# Altium schematic sheet USB.SchDoc
size A4; SheetNumber: 4; SheetTotal: 4
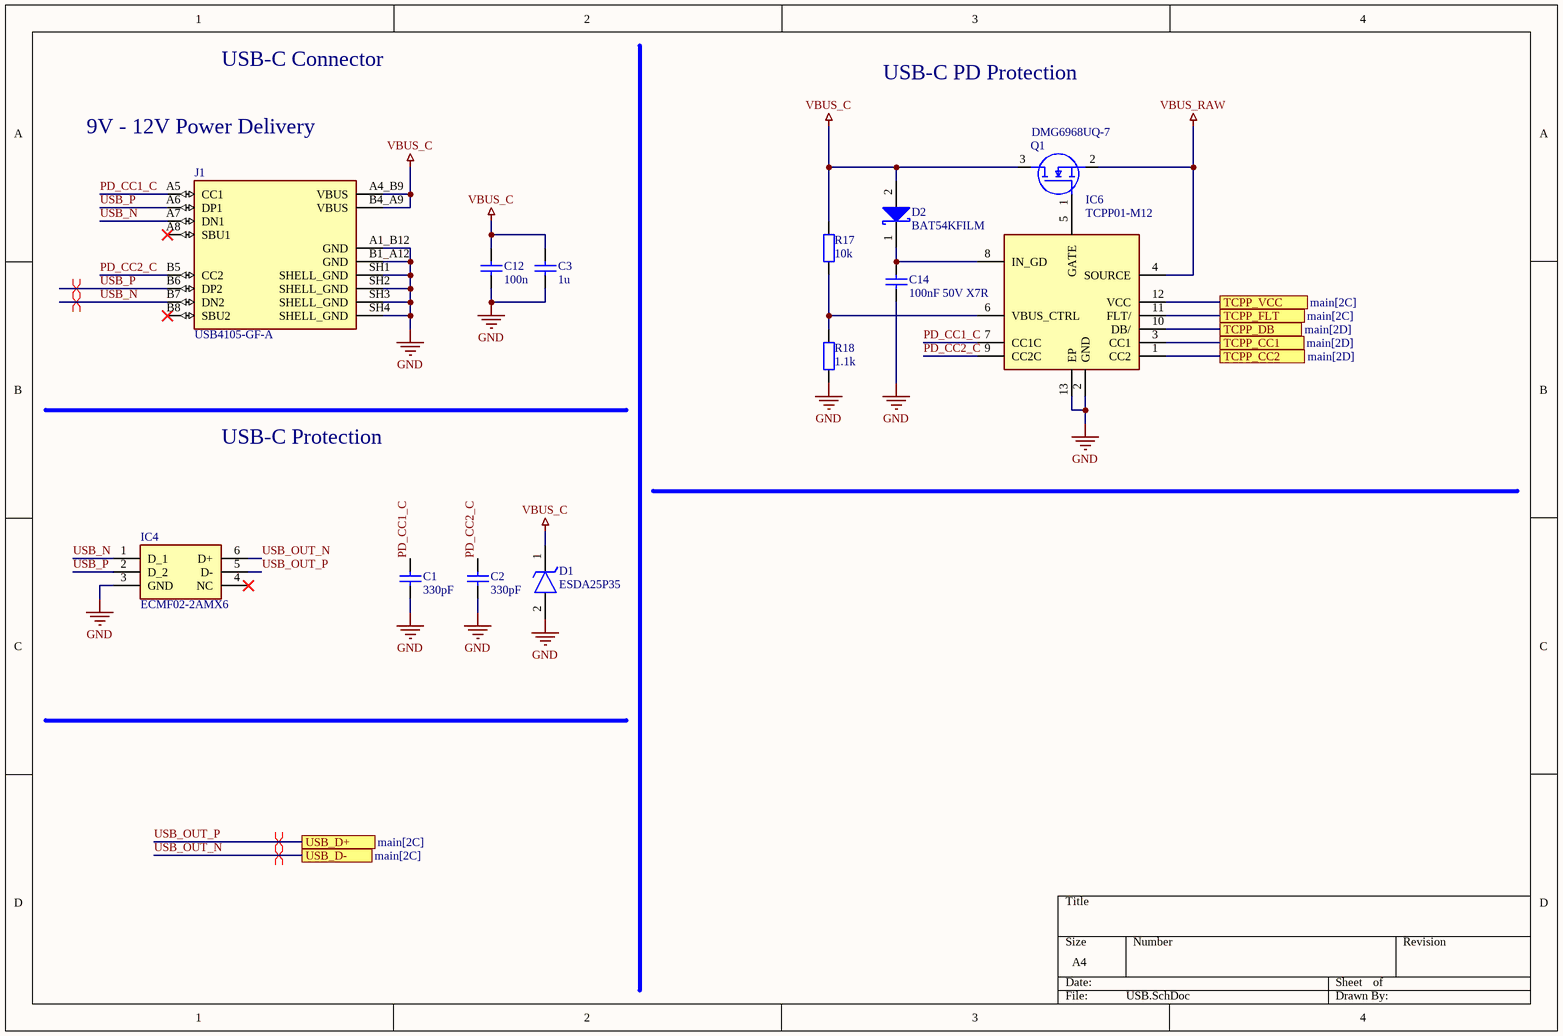
[diagram p0: USB.SchDoc]

## Parts
C1  330pF  [1608[0603]]
C2  330pF  [1608[0603]]
C3  1u  [1608[0603]]
C12  100n  [1608[0603]]
C14  100nF 50V X7R  [1608[0603]]
D1  ESDA25P35  [ESDA25P351U1M]
D2  BAT54KFILM  [SODFL1608X70N]
IC4  ECMF02-2AMX6  [SON50P150X170X55-6N-D]
IC6  TCPP01-M12  [QFN50P300X300X100-13N-D]
J1  USB4105-GF-A  [GCT_USB4105-GF-A]
Q1  DMG6968UQ-7  [SOT96P240X110-3N]
R17  10k  [J1-0603]
R18  1.1k  [J1-0603]

## Ports
TCPP_CC1 (see main[2D]), TCPP_CC2 (see main[2D]), TCPP_DB (see main[2D]), TCPP_FLT (see main[2C]), TCPP_VCC (see main[2C]), USB_D+ (see main[2C]), USB_D- (see main[2C])

## Nets
GND: C1.1 C2.1 C3.1 C12.1 C14.1 D1.2(A) IC4.3(GND) IC6.2(GND) IC6.13(EP) J1.A1_B12(GND) J1.B1_A12(GND) J1.SH1(SHELL_GND) J1.SH2(SHELL_GND) J1.SH3(SHELL_GND) J1.SH4(SHELL_GND) R18.1
VBUS_C: C3.2 C12.2 D1.1(K) D2.2(A) J1.A4_B9(VBUS) J1.B4_A9(VBUS) Q1.3(D) R17.2
VBUS_RAW: IC6.4(SOURCE) Q1.2(S)
PD_CC1_C: C1.2 IC6.7(CC1C) J1.A5(CC1)
PD_CC2_C: C2.2 IC6.9(CC2C) J1.B5(CC2)
TCPP_CC1: IC6.3(CC1) ; port TCPP_CC1
TCPP_CC2: IC6.1(CC2) ; port TCPP_CC2
TCPP_DB: IC6.10(DB/) ; port TCPP_DB
TCPP_FLT: IC6.11(FLT/) ; port TCPP_FLT
TCPP_VCC: IC6.12(VCC) ; port TCPP_VCC
USB_N: IC4.1(D_1) J1.A7(DN1) J1.B7(DN2)
USB_OUT_N: IC4.6(D+) ; port USB_D-
USB_OUT_P: IC4.5(D-) ; port USB_D+
USB_P: IC4.2(D_2) J1.A6(DP1) J1.B6(DP2)
NetC14_2: C14.2 D2.1(K) IC6.8(IN_GD)
NetIC6_5: IC6.5(GATE) Q1.1(G)
NetIC6_6: IC6.6(VBUS_CTRL) R17.1 R18.2

Not connected (* = marked no-connect by the designer): IC4 4(NC)*; J1 A8(SBU1)* B8(SBU2)*

## Layout directives
differential pair; net class USB: USB_N, USB_P
differential pair: USB_OUT_N, USB_OUT_P

## Notes on the sheet
- USB-C Connector
- USB-C PD Protection
- 9V - 12V Power Delivery
- USB-C Protection

## Library data of the parts
C1 C2 = Cap: Capacitor; Published: 8-Jun-2000; LatestRevisionDate: 17-Jul-2002; LatestRevisionNote: Re-released for DXP Platform.; PackageReference: RAD-0.3; Publisher: Altium Limited; PackageDescription: Radial Cap, Thru-Hole; 2 Leads; 0.3 in Pin Spacing; Value: 330pF
C3 C12 = Cap: Capacitor; Value: 100pF; Published: 8-Jun-2000; LatestRevisionDate: 17-Jul-2002; LatestRevisionNote: Re-released for DXP Platform.; PackageReference: RAD-0.3; Publisher: Altium Limited; PackageDescription: Radial Cap, Thru-Hole; 2 Leads; 0.3 in Pin Spacing
C14 = Cap: 50 V X7R 100 nF capacitor; Published: 8-Jun-2000; LatestRevisionDate: 17-Jul-2002; LatestRevisionNote: Re-released for DXP Platform.; PackageReference: RAD-0.3; Publisher: Altium Limited; PackageDescription: Radial Cap, Thru-Hole; 2 Leads; 0.3 in Pin Spacing; Value: 100nF
D1 = ESDA25P35-1U1M: TVS Diode (Uni-directional); Manufacturer_Name: STMicroelectronics; Datasheet Link: https://www.st.com/resource/en/datasheet/esda25p35-1u1m.pdf; Height: 0.6mm; Manufacturer_Part_Number: ESDA25P35-1U1M; Mouser Part Number: 511-ESDA25P35-1U1M; Mouser Price/Stock: https://www.mouser.co.uk/ProductDetail/STMicroelectronics/ESDA25P35-1U1M?qs=aVyJF2WnouQUWqgNP85ZrA%3D%3D; Arrow Part Number: ESDA25P35-1U1M; Arrow Price/Stock: https://www.arrow.com/en/products/esda25p35-1u1m/stmicroelectronics?utm_currency=USD&region=europe
D2 = BAT54KFILM: Diode; Manufacturer_Name: STMicroelectronics; Datasheet Link: http://www.st.com/web/en/resource/technical/document/datasheet/CD00001322.pdf; Height: 0.7mm; Manufacturer_Part_Number: BAT54KFILM; Mouser Part Number: 511-BAT54KFILM; Mouser Price/Stock: https://www.mouser.co.uk/ProductDetail/STMicroelectronics/BAT54KFILM?qs=jZi1jxfVU95Y9ce6l3OT%252BA%3D%3D; Arrow Part Number: BAT54KFILM; Arrow Price/Stock: https://www.arrow.com/en/products/bat54kfilm/stmicroelectronics?region=europe
IC4 = ECMF02-2AMX6: Integrated Circuit; Manufacturer_Name: STMicroelectronics; Datasheet Link: http://www.st.com/content/ccc/resource/technical/document/datasheet/3a/28/cf/d0/31/63/48/8c/CD00282307.pdf/files/CD00282307.pdf/jcr:content/translations/en.CD00282307.pdf; Height: 0.55mm; Manufacturer_Part_Number: ECMF02-2AMX6; Mouser Part Number: 511-ECMF02-2AMX6; Mouser Price/Stock: https://www.mouser.co.uk/ProductDetail/STMicroelectronics/ECMF02-2AMX6?qs=raAh8RbVwI65u5gmT42%2Flg%3D%3D; Arrow Part Number: ECMF02-2AMX6; Arrow Price/Stock: https://www.arrow.com/en/products/ecmf02-2amx6/stmicroelectronics?utm_currency=USD&region=europe
IC6 = TCPP01-M12: Integrated Circuit; Manufacturer_Name: STMicroelectronics; Datasheet Link: https://www.st.com/resource/en/datasheet/tcpp01-m12.pdf; Height: 1mm; Manufacturer_Part_Number: TCPP01-M12; Mouser Part Number: 511-TCPP01-M12; Mouser Price/Stock: https://www.mouser.co.uk/ProductDetail/STMicroelectronics/TCPP01-M12?qs=%252B6g0mu59x7KCafIwapwG2A%3D%3D; Arrow Part Number: TCPP01-M12; Arrow Price/Stock: https://www.arrow.com/en/products/tcpp01-m12/stmicroelectronics?utm_currency=USD&region=nac
J1 = USB4105-GF-A: MF: {'manufacturer': u'GCT'}; Package: None; Price: None; Value: *; MP: USB4105-GF-A; Availability: Unavailable
Q1 = DMG6968UQ-7: MOSFET (N-Channel); Manufacturer_Name: Diodes Incorporated; Datasheet Link: https://www.diodes.com//assets/Datasheets/products_inactive_data/DMG6968UQ.pdf; Height: 1.1mm; Manufacturer_Part_Number: DMG6968UQ-7; Mouser Part Number: 621-DMG6968UQ-7; Mouser Price/Stock: https://www.mouser.co.uk/ProductDetail/Diodes-Incorporated/DMG6968UQ-7?qs=MNIFWdyJgboErGB0%2FFpP4Q%3D%3D; Arrow Part Number: DMG6968UQ-7; Arrow Price/Stock: https://www.arrow.com/en/products/dmg6968uq-7/diodes-incorporated?region=asia
R17 R18 = Res2: Resistor; Value: 1K; Published: 8-Jun-2000; LatestRevisionDate: 17-Jul-2002; LatestRevisionNote: Re-released for DXP Platform.; PackageReference: AXIAL-0.4; Publisher: Altium Limited; PackageDescription: Axial Device, Thru-Hole; 2 Leads; 0.4 in Pin Spacing